# EasyEDA schematic 555 timer_2021-06-11.json
TITLE: Sheet_1; REV: 1.0; Date: 2021-06-10; Sheet: 1/1; Drawn By: limchengwei; Company: Your Company
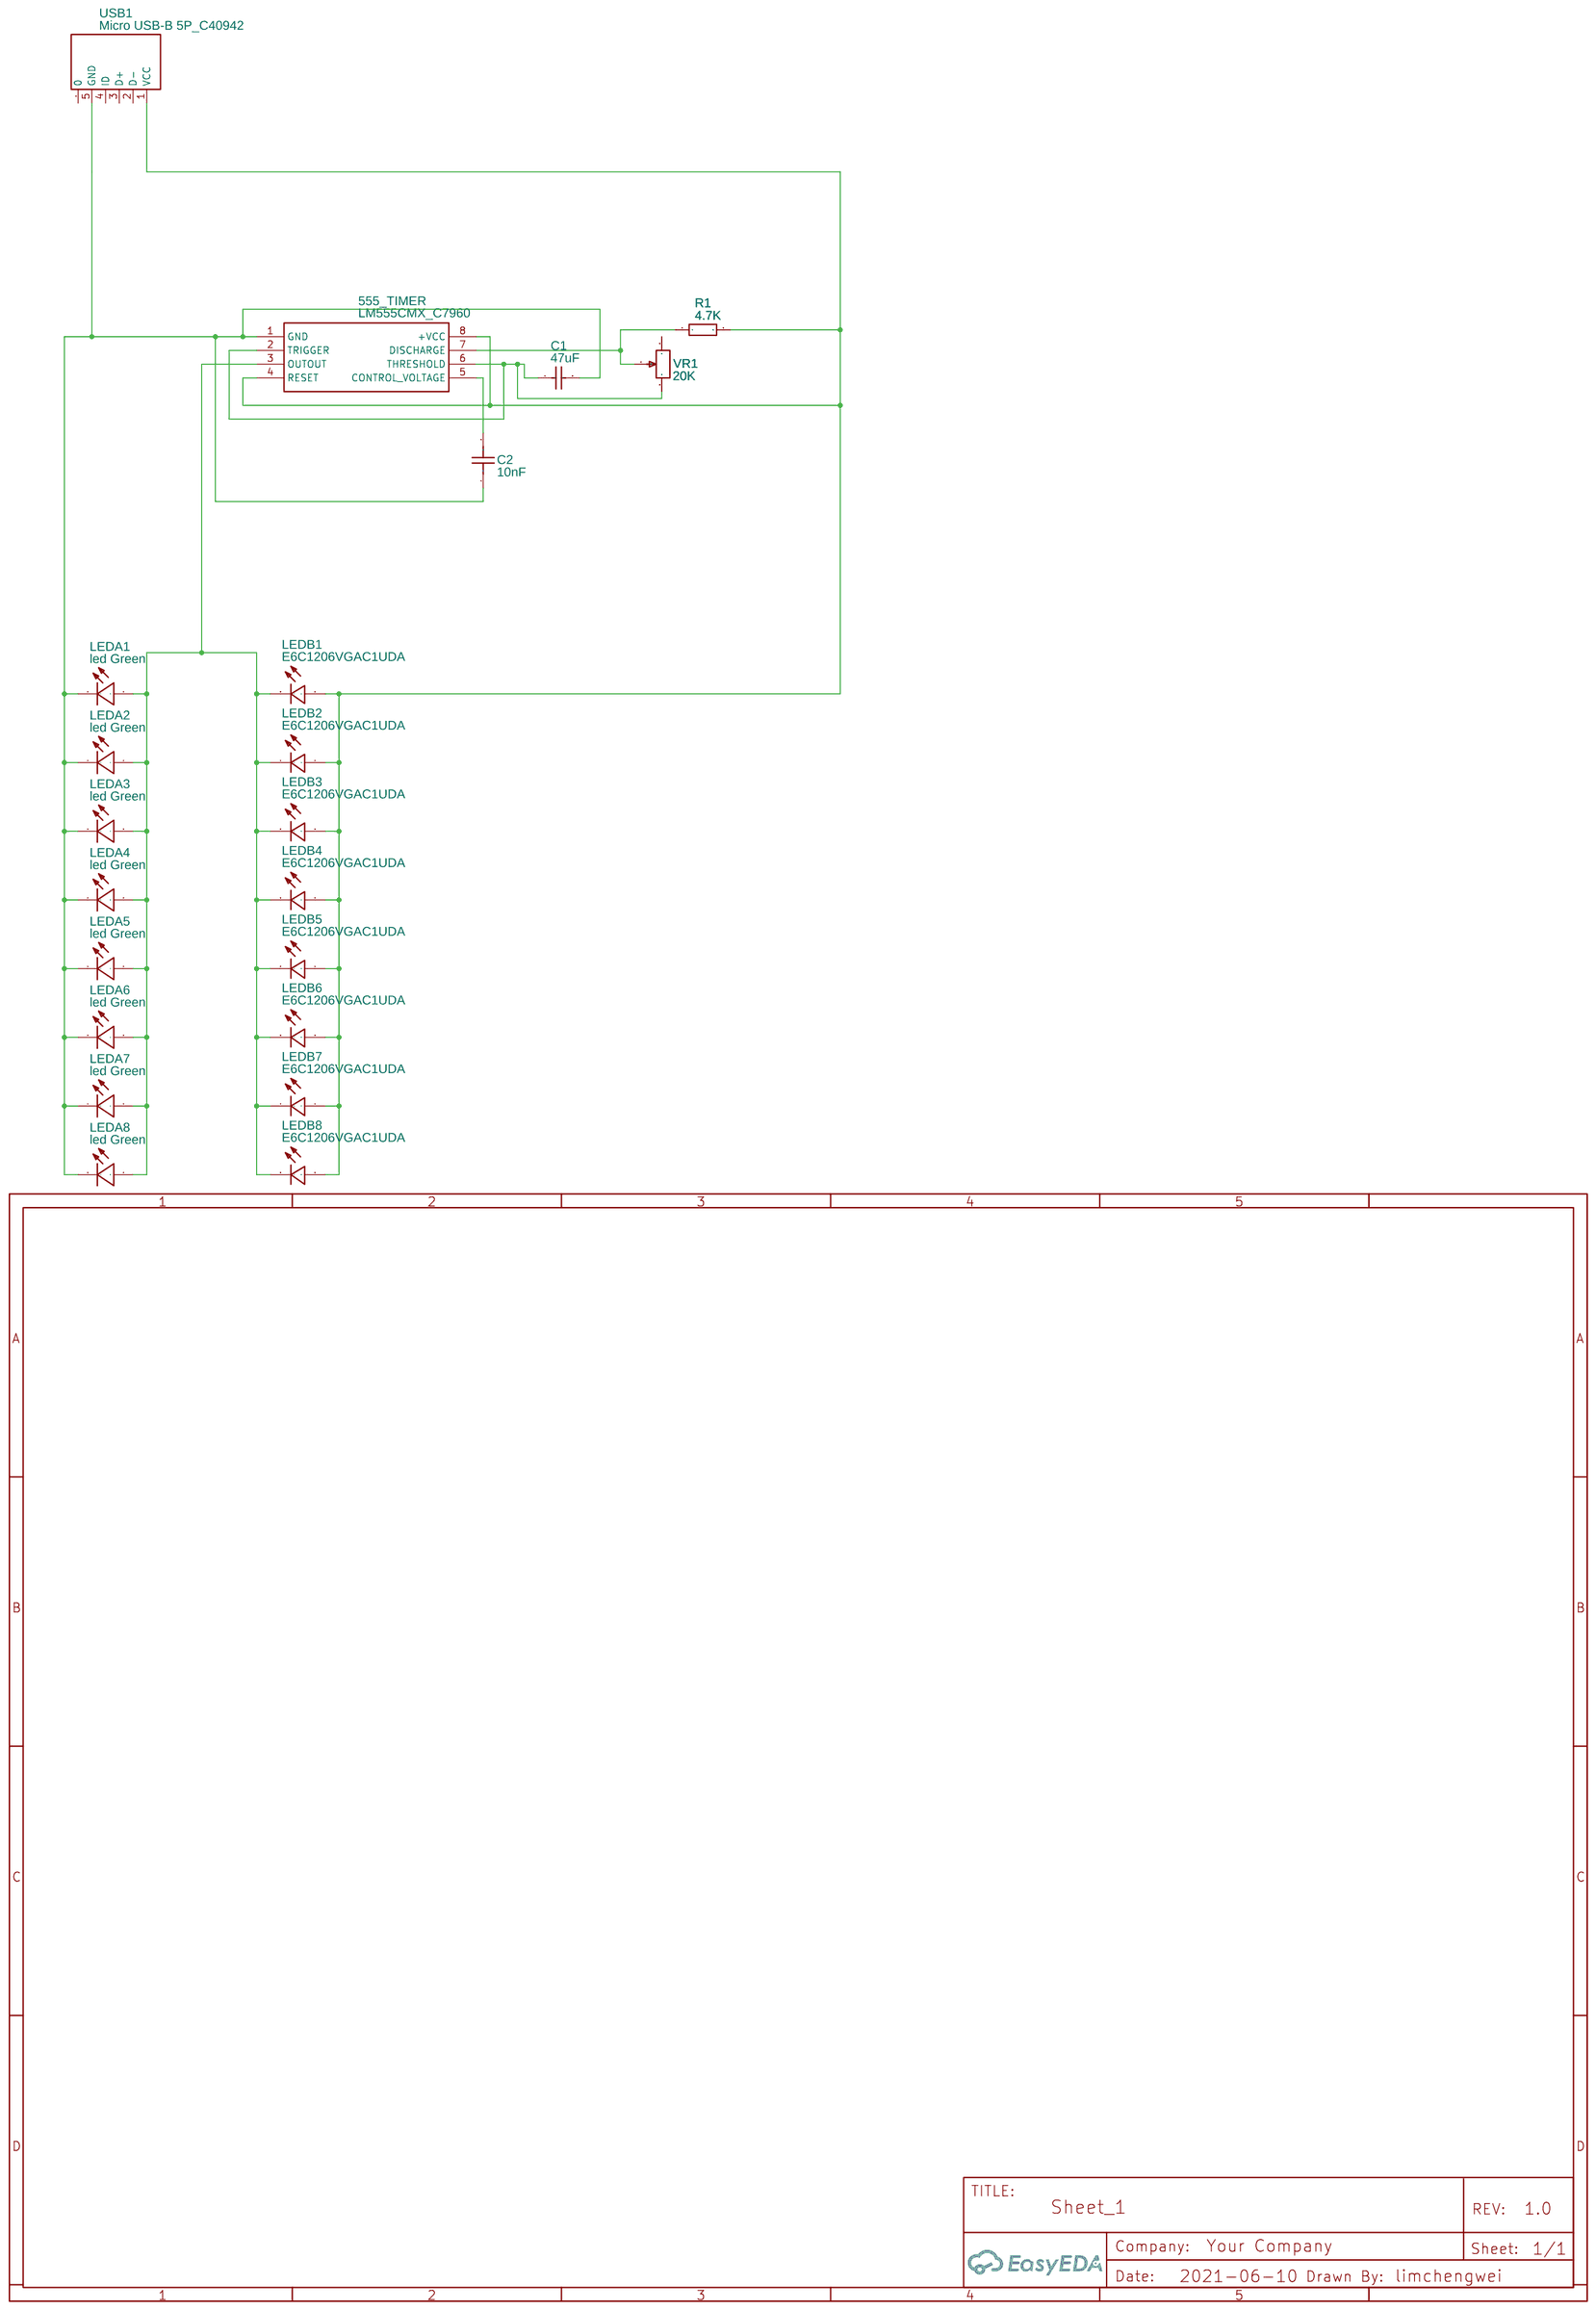
[diagram p0: schematic sheet]

## Parts
555_TIMER  LM555CMX_C7960  [SOIC-8_L5.0-W4.0-P1.27-LS6.0-BL]
C1  47uF  [C1210]
C2  10nF  [C1210]
LEDA1  led Green  [LED1206-RD]
LEDA2  led Green  [LED1206-RD]
LEDA3  led Green  [LED1206-RD]
LEDA4  led Green  [LED1206-RD]
LEDA5  led Green  [LED1206-RD]
LEDA6  led Green  [LED1206-RD]
LEDA7  led Green  [LED1206-RD]
LEDA8  led Green  [LED1206-RD]
LEDB1  E6C1206VGAC1UDA  [LED1206-R-RD]
LEDB2  E6C1206VGAC1UDA  [LED1206-R-RD]
LEDB3  E6C1206VGAC1UDA  [LED1206-R-RD]
LEDB4  E6C1206VGAC1UDA  [LED1206-R-RD]
LEDB5  E6C1206VGAC1UDA  [LED1206-R-RD]
LEDB6  E6C1206VGAC1UDA  [LED1206-R-RD]
LEDB7  E6C1206VGAC1UDA  [LED1206-R-RD]
LEDB8  E6C1206VGAC1UDA  [LED1206-R-RD]
R1  4.7K  [R1210]
USB1  Micro USB-B 5P_C40942  [MICRO-USB-SMD_5P-P0.65-H-M_MICRO-USB-5P]
VR1  20K  [RES-ADJ-SMD_3P-L4.5-W4.5-P2.30-BL-FS]

## Library data of the parts
555_TIMER = LM555CMX_C7960: sourceId: EW5EweR0g; Supplier: LCSC; Manufacturer: TI; Manufacturer Part: LM555CMX; Supplier Part: C7960; JLCPCB Part Class: Extended Part
C1 = CL32A476MQJNNWE: Supplier: LCSC; Manufacturer: SAMSUNG; Supplier Part: C12605; JLCPCB Part Class: Extended Part
C2 = GCM32D7U2J103JX01L: Supplier: LCSC; Supplier Part: C161278; Manufacturer: Murata Electronics; Contributor: LCSC; JLCPCB Part Class: Extended Part
LEDA1-LEDA8 = led Green: Supplier: LCSC; Manufacturer: KENTO; Supplier Part: C14641; JLCPCB Part Class: Extended Part
LEDB1-LEDB8 = E6C1206VGAC1UDA: Supplier: LCSC; Supplier Part: C375461; Manufacturer: EKINGLUX; Contributor: LCSC; JLCPCB Part Class: Extended Part
R1 = 1210W3F4701T5E: Supplier: LCSC; Manufacturer: UniOhm; Supplier Part: C52443; JLCPCB Part Class: Extended Part
USB1 = Micro USB-B 5P_C40942: Supplier: LCSC; Manufacturer: ValuePro; Supplier Part: C40942; JLCPCB Part Class: Extended Part
VR1 = 3314J-1-203E: Supplier: LCSC; Manufacturer: BOURNS; Supplier Part: C55069; JLCPCB Part Class: Extended Part

## Nets
Net-(555_TIMER-1): 555_TIMER.1(GND) C1.2 C2.1 LEDA1.1(-) LEDA2.1(-) LEDA3.1(-) LEDA4.1(-) LEDA5.1(-) LEDA6.1(-) LEDA7.1(-) LEDA8.1(-) USB1.5(GND)
Net-(555_TIMER-2): 555_TIMER.2(TRIGGER) 555_TIMER.6(THRESHOLD) C1.1 VR1.3
Net-(555_TIMER-3): 555_TIMER.3(OUTOUT) LEDA1.2(+) LEDA2.2(+) LEDA3.2(+) LEDA4.2(+) LEDA5.2(+) LEDA6.2(+) LEDA7.2(+) LEDA8.2(+) LEDB1.2(-) LEDB2.2(-) LEDB3.2(-) LEDB4.2(-) LEDB5.2(-) LEDB6.2(-) LEDB7.2(-) LEDB8.2(-)
Net-(555_TIMER-4): 555_TIMER.4(RESET) 555_TIMER.8(+VCC) LEDB1.1(+) LEDB2.1(+) LEDB3.1(+) LEDB4.1(+) LEDB5.1(+) LEDB6.1(+) LEDB7.1(+) LEDB8.1(+) R1.2 USB1.1(VCC)
Net-(555_TIMER-5): 555_TIMER.5(CONTROL VOLTAGE) C2.2
Net-(555_TIMER-7): 555_TIMER.7(DISCHARGE) R1.1 VR1.2

Not connected (* = marked no-connect by the designer): USB1 0 2(D-) 3(D+) 4(ID); VR1 1
